# EAGLE design 8x8 led matrix 2 layer (EAGLE 6.4)
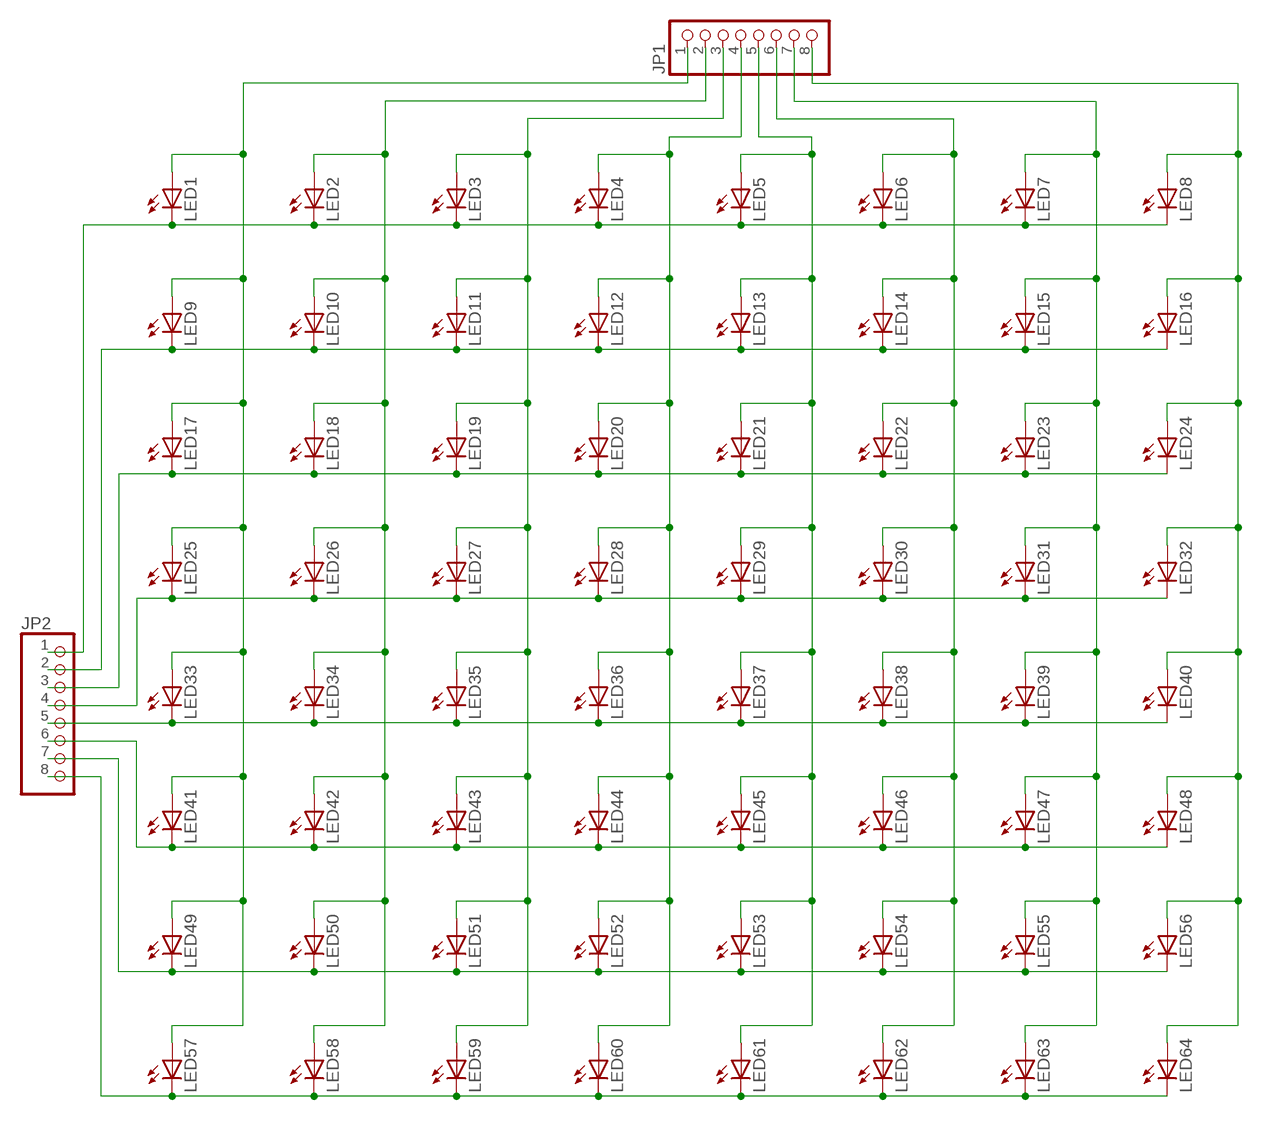
[diagram p0: schematic, sheet 1]

## Parts
JP1  PINHD-1X8  [1X08]
JP2  PINHD-1X8  [1X08]
LED1  LED5MM  [LED5MM]
LED2  LED5MM  [LED5MM]
LED3  LED5MM  [LED5MM]
LED4  LED5MM  [LED5MM]
LED5  LED5MM  [LED5MM]
LED6  LED5MM  [LED5MM]
LED7  LED5MM  [LED5MM]
LED8  LED5MM  [LED5MM]
LED9  LED5MM  [LED5MM]
LED10  LED5MM  [LED5MM]
LED11  LED5MM  [LED5MM]
LED12  LED5MM  [LED5MM]
LED13  LED5MM  [LED5MM]
LED14  LED5MM  [LED5MM]
LED15  LED5MM  [LED5MM]
LED16  LED5MM  [LED5MM]
LED17  LED5MM  [LED5MM]
LED18  LED5MM  [LED5MM]
LED19  LED5MM  [LED5MM]
LED20  LED5MM  [LED5MM]
LED21  LED5MM  [LED5MM]
LED22  LED5MM  [LED5MM]
LED23  LED5MM  [LED5MM]
LED24  LED5MM  [LED5MM]
LED25  LED5MM  [LED5MM]
LED26  LED5MM  [LED5MM]
LED27  LED5MM  [LED5MM]
LED28  LED5MM  [LED5MM]
LED29  LED5MM  [LED5MM]
LED30  LED5MM  [LED5MM]
LED31  LED5MM  [LED5MM]
LED32  LED5MM  [LED5MM]
LED33  LED5MM  [LED5MM]
LED34  LED5MM  [LED5MM]
LED35  LED5MM  [LED5MM]
LED36  LED5MM  [LED5MM]
LED37  LED5MM  [LED5MM]
LED38  LED5MM  [LED5MM]
LED39  LED5MM  [LED5MM]
LED40  LED5MM  [LED5MM]
LED41  LED5MM  [LED5MM]
LED42  LED5MM  [LED5MM]
LED43  LED5MM  [LED5MM]
LED44  LED5MM  [LED5MM]
LED45  LED5MM  [LED5MM]
LED46  LED5MM  [LED5MM]
LED47  LED5MM  [LED5MM]
LED48  LED5MM  [LED5MM]
LED49  LED5MM  [LED5MM]
LED50  LED5MM  [LED5MM]
LED51  LED5MM  [LED5MM]
LED52  LED5MM  [LED5MM]
LED53  LED5MM  [LED5MM]
LED54  LED5MM  [LED5MM]
LED55  LED5MM  [LED5MM]
LED56  LED5MM  [LED5MM]
LED57  LED5MM  [LED5MM]
LED58  LED5MM  [LED5MM]
LED59  LED5MM  [LED5MM]
LED60  LED5MM  [LED5MM]
LED61  LED5MM  [LED5MM]
LED62  LED5MM  [LED5MM]
LED63  LED5MM  [LED5MM]
LED64  LED5MM  [LED5MM]

## Nets
N$12: JP1.4 LED4.A LED12.A LED20.A LED28.A LED36.A LED44.A LED52.A LED60.A
N$14: JP1.5 LED5.A LED13.A LED21.A LED29.A LED37.A LED45.A LED53.A LED61.A
N$17: JP1.1 LED1.A LED9.A LED17.A
N$21: JP1.3 LED3.A LED11.A LED19.A LED27.A LED35.A LED43.A LED51.A LED59.A
N$28: JP1.6 LED6.A LED14.A LED22.A LED30.A LED38.A LED46.A LED54.A LED62.A
N$30: JP1.7 LED7.A LED15.A LED23.A LED31.A LED39.A LED47.A LED55.A LED63.A
N$33: JP2.1 LED1.K(C) LED2.K(C) LED3.K(C) LED4.K(C) LED5.K(C) LED6.K(C) LED7.K(C) LED8.K(C)
N$50: JP2.2 LED9.K(C) LED10.K(C) LED11.K(C) LED12.K(C) LED13.K(C) LED14.K(C) LED15.K(C) LED16.K(C)
N$67: JP2.3 LED17.K(C) LED18.K(C) LED19.K(C) LED20.K(C) LED21.K(C) LED22.K(C) LED23.K(C) LED24.K(C)
N$76: LED25.A LED33.A LED41.A LED49.A LED57.A
N$84: JP2.4 LED25.K(C) LED26.K(C) LED27.K(C) LED28.K(C) LED29.K(C) LED30.K(C) LED31.K(C) LED32.K(C)
N$101: JP2.5 LED33.K(C) LED34.K(C) LED35.K(C) LED36.K(C) LED37.K(C) LED38.K(C) LED39.K(C) LED40.K(C)
N$118: JP2.6 LED41.K(C) LED42.K(C) LED43.K(C) LED44.K(C) LED45.K(C) LED46.K(C) LED47.K(C) LED48.K(C)
N$134: JP1.8 LED8.A LED16.A LED24.A LED32.A LED40.A LED48.A LED56.A LED64.A
N$135: JP2.7 LED49.K(C) LED50.K(C) LED51.K(C) LED52.K(C) LED53.K(C) LED54.K(C) LED55.K(C) LED56.K(C)
N$145: JP1.2 LED2.A LED10.A LED18.A LED26.A LED34.A LED42.A LED50.A LED58.A
N$152: JP2.8 LED57.K(C) LED58.K(C) LED59.K(C) LED60.K(C) LED61.K(C) LED62.K(C) LED63.K(C) LED64.K(C)

## Library data of the parts
JP1 JP2 = pinhead:PINHD-1X8: PIN HEADER
LED1-LED64 = led:LED: LED OSRAM: - CHIPLED LG R971, LG N971, LY N971, LG Q971, LY Q971, LO R971, LY R971 LH N974, LH R974 LS Q976, LO Q976, LY Q976 LO Q996 - Hyper CHIPLED LW Q18S LB Q993, LB Q99A, LB R99A - SideLED LS A670, LO A670, LY A670, LG A670, LP A670 LB A673, LV A673, LT A673, LW A673 LH A674 LY A675 LS A676, LA A676, LO A676, LY A676, LW A676 LS A679, LY A679, LG A679 - Hyper Micro SIDELED® LS Y876, LA Y876, LO Y876, LY Y876 LT Y87S - SmartLED LW L88C, LW L88S LB L89C, LB L89S, LG L890 LS L89K, LO L89K, LY L89K LS L896, LA L896, LO L896, LY L896 - TOPLED LS T670, LO T670, LY T670, LG T670, LP T670 LSG T670, LSP T670, LSY T670, LOP T670, LYG T670 LG T671, LOG T671, LSG T671 LB T673, LV T673, LT T673, LW T673 LH T674 LS T676, LA T676, LO T676, LY T676, LB T676, LH T676, LSB T676, LW T676 LB T67C, LV T67C, LT T67C, LS T67K, LO T67K, LY T67K, LW E67C LS E67B, LA E67B, LO E67B, LY E67B, LB E67C, LV E67C, LT E67C LW T67C LS T679, LY T679, LG T679 LS T770, LO T770, LY T770, LG T770, LP T770 LB T773, LV T773, LT T773, LW T773 LH T774 LS E675, LA E675, LY E675, LS T675 LS T776, LA T776, LO T776, LY T776, LB T776 LHGB T686 LT T68C, LB T68C - Hyper Mini TOPLED® LB M676 - Mini TOPLED Santana® LG M470 LS M47K, LO M47K, LY M47K Source: http://www.osram.convergy.de LUXEON: - LUMILED® LXK2-PW12-R00, LXK2-PW12-S00, LXK2-PW14-U00, LXK2-PW14-V00 LXK2-PM12-R00, LXK2-PM12-S00, LXK2-PM14-U00 LXK2-PE12-Q00, LXK2-PE12-R00, LXK2-PE12-S00, LXK2-PE14-T00, LXK2-PE14-U00 LXK2-PB12-K00, LXK2-PB12-L00, LXK2-PB12-M00, LXK2-PB14-N00, LXK2-PB14-P00, LXK2-PB14-Q00 LXK2-PR12-L00, LXK2-PR12-M00, LXK2-PR14-Q00, LXK2-PR14-R00 LXK2-PD12-Q00, LXK2-PD12-R00, LXK2-PD12-S00 LXK2-PH12-R00, LXK2-PH12-S00 LXK2-PL12-P00, LXK2-PL12-Q00, LXK2-PL12-R00 Source: www.luxeon.com KINGBRIGHT: KA-3528ASYC Source: www.kingbright.com

## Board
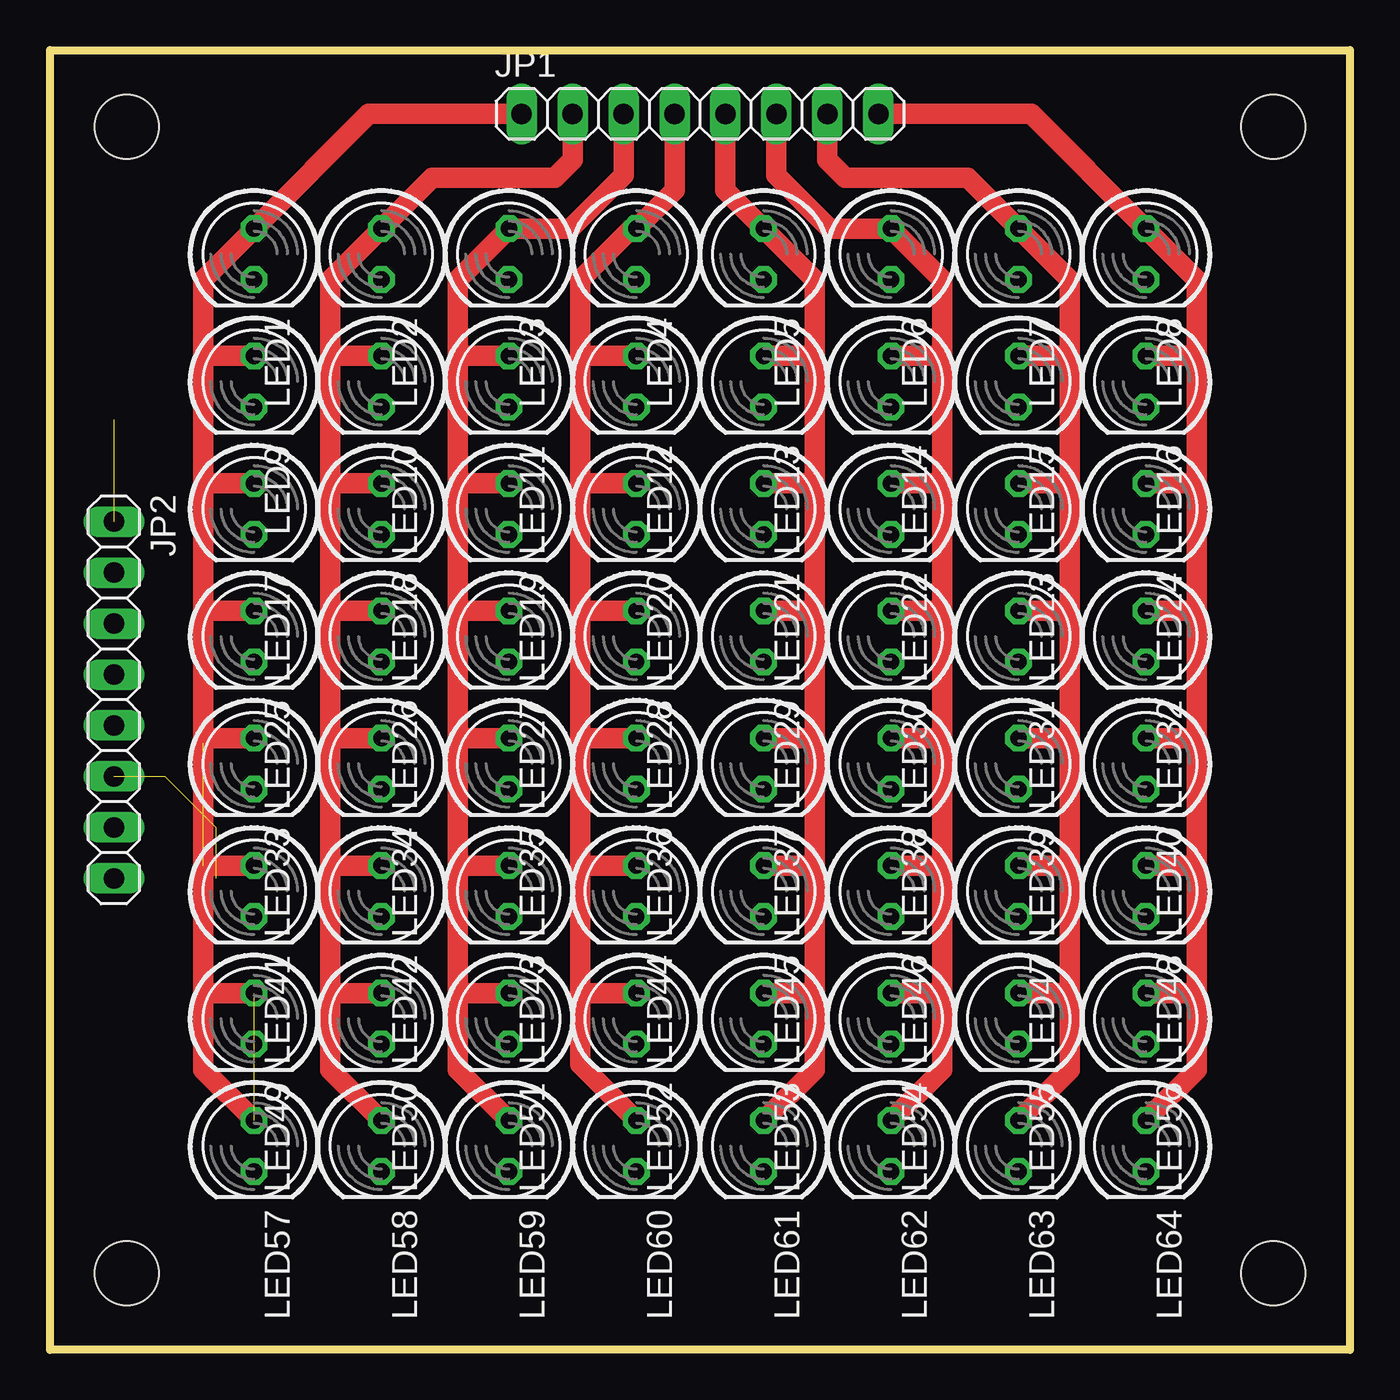
[diagram p1: board, top side]
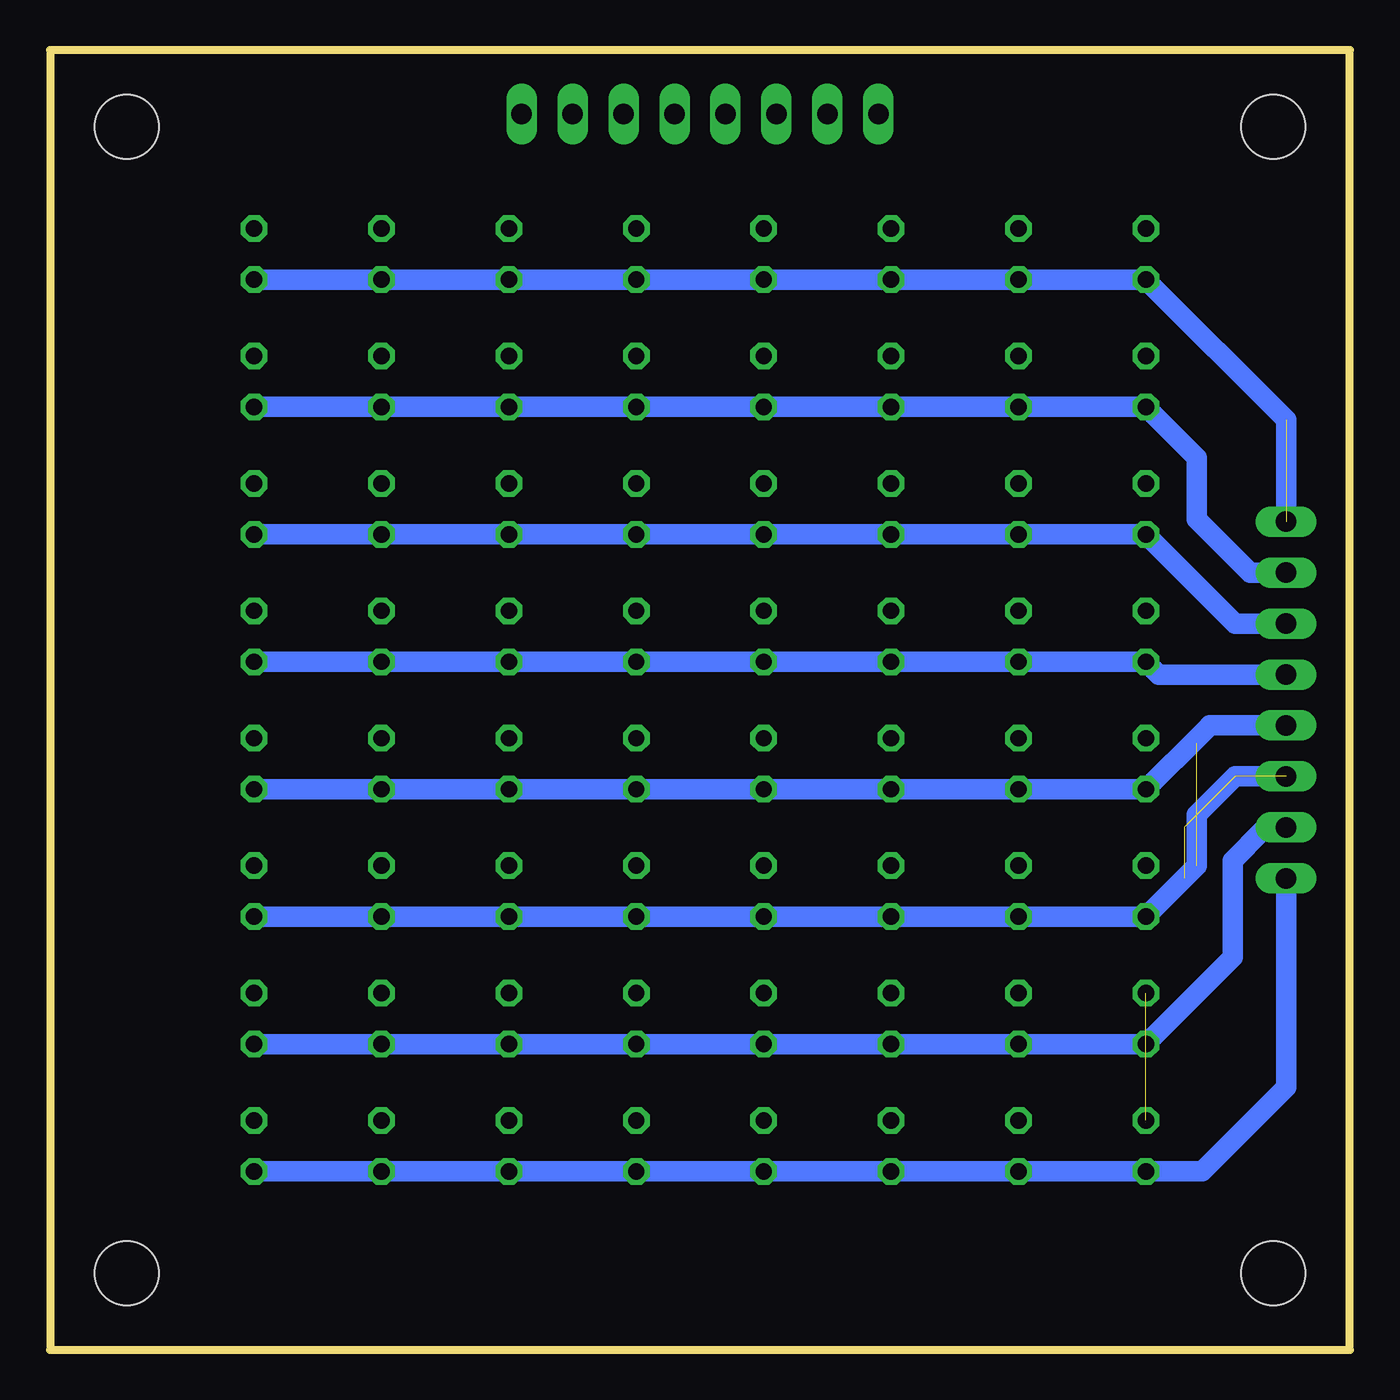
[diagram p2: board, bottom side, seen from below]

Size 64.77 x 64.77 mm. Coordinates in mm from the lower left corner, seen from the top.
Outline: 64.77,0 0,0 0,64.77 64.77,64.77 64.77,0
Copper layers (1*16): Top 0.035mm / dielectric 1.5mm / Bottom 0.035mm
Design rules "default": minimum track width 10mil, minimum drill 24mil, track to track 8mil, track to pad 8mil, pad to pad 8mil, via to via 8mil, smd to smd 8mil, copper to edge 40mil, drill to drill 8mil, minimum pad ring 10mil, minimum via ring 8mil, stop-mask expansion 4mil, vias tented up to drill 0mil, thermal gap 10mil
Holes 3.2 mm at -15.24,7.62 3.81,3.81 60.96,3.81 3.81,60.96 60.96,60.96

### Footprints (pad centres in the part's own frame; a part is rotated, then mirrored left to right if it is on the bottom)
1X08 = drill 1.016 long: 1 -8.89,0; 2 -6.35,0; 3 -3.81,0; 4 -1.27,0; 5 1.27,0; 6 3.81,0; 7 6.35,0; 8 8.89,0
LED5MM = drill 0.813 octagon: A -1.27,0; K 1.27,0

### Placement (x,y rotation side)
JP1  32.38,61.6 0 top
JP2  3.17,32.38 270 top
LED1  10.16,54.61 270 top
LED2  16.51,54.61 270 top
LED3  22.86,54.61 270 top
LED4  29.21,54.61 270 top
LED5  35.56,54.61 270 top
LED6  41.91,54.61 270 top
LED7  48.26,54.61 270 top
LED8  54.61,54.61 270 top
LED9  10.16,48.26 270 top
LED10  16.51,48.26 270 top
LED11  22.86,48.26 270 top
LED12  29.21,48.26 270 top
LED13  35.56,48.26 270 top
LED14  41.91,48.26 270 top
LED15  48.26,48.26 270 top
LED16  54.61,48.26 270 top
LED17  10.16,41.91 270 top
LED18  16.51,41.91 270 top
LED19  22.86,41.91 270 top
LED20  29.21,41.91 270 top
LED21  35.56,41.91 270 top
LED22  41.91,41.91 270 top
LED23  48.26,41.91 270 top
LED24  54.61,41.91 270 top
LED25  10.16,35.56 270 top
LED26  16.51,35.56 270 top
LED27  22.86,35.56 270 top
LED28  29.21,35.56 270 top
LED29  35.56,35.56 270 top
LED30  41.91,35.56 270 top
LED31  48.26,35.56 270 top
LED32  54.61,35.56 270 top
LED33  10.16,29.21 270 top
LED34  16.51,29.21 270 top
LED35  22.86,29.21 270 top
LED36  29.21,29.21 270 top
LED37  35.56,29.21 270 top
LED38  41.91,29.21 270 top
LED39  48.26,29.21 270 top
LED40  54.61,29.21 270 top
LED41  10.16,22.86 270 top
LED42  16.51,22.86 270 top
LED43  22.86,22.86 270 top
LED44  29.21,22.86 270 top
LED45  35.56,22.86 270 top
LED46  41.91,22.86 270 top
LED47  48.26,22.86 270 top
LED48  54.61,22.86 270 top
LED49  10.16,16.51 270 top
LED50  16.51,16.51 270 top
LED51  22.86,16.51 270 top
LED52  29.21,16.51 270 top
LED53  35.56,16.51 270 top
LED54  41.91,16.51 270 top
LED55  48.26,16.51 270 top
LED56  54.61,16.51 270 top
LED57  10.16,10.16 270 top
LED58  16.51,10.16 270 top
LED59  22.86,10.16 270 top
LED60  29.21,10.16 270 top
LED61  35.56,10.16 270 top
LED62  41.91,10.16 270 top
LED63  48.26,10.16 270 top
LED64  54.61,10.16 270 top

### Tracks (layer width: path | path; a pad name or v marks a point on that pad's centre or on a via)
N$12
  Top 1.016: JP1.4 31.12,57.79 LED4.A 28.96,55.88 26.42,53.34 26.42,49.53 | 26.42,49.53 26.42,43.18 | 26.42,43.18 26.42,36.83 | 26.42,36.83 26.42,30.23 | 26.42,30.23 26.42,24.13 | 26.42,24.13 26.42,17.78 | 26.42,17.78 26.42,14.22 LED60.A | LED52.A 26.42,17.78 | LED44.A 26.42,24.13 | LED36.A 26.67,30.48 26.42,30.23 | LED28.A 26.42,36.83 | LED20.A 26.42,43.18 | LED12.A 26.42,49.53
N$14
  Top 1.016: JP1.5 33.66,57.79 LED5.A 38.1,53.34 38.1,49.53 | 38.1,49.53 38.1,43.18 | 38.1,43.18 38.1,36.83 | 38.1,36.83 38.1,30.48 | 38.1,30.48 38.1,24.13 | 38.1,24.13 38.1,17.78 | 38.1,17.78 38.1,13.97 LED61.A | LED53.A 38.1,17.78 | LED45.A 38.1,24.13 | LED37.A 38.1,30.48 | LED29.A 38.1,36.83 | LED21.A 38.1,43.18 | LED13.A 38.1,49.53
N$17
  Top 1.016: JP1.1 15.87,61.6 LED1.A 7.62,53.34 7.62,49.53 | 7.62,49.53 7.62,43.18 | 7.62,43.18 7.62,13.97 10.16,11.43 | LED9.A 7.62,49.53 | LED17.A 7.62,43.18
N$21
  Top 1.016: JP1.3 28.58,58.55 25.91,55.88 LED3.A 20.32,53.34 20.32,49.28 | LED59.A 20.32,13.97 20.32,17.78 | 20.32,49.28 20.32,43.18 | 20.32,43.18 20.32,36.58 | 20.32,36.58 20.32,30.23 | 20.32,30.23 20.32,23.88 | 20.32,23.88 20.32,17.78 | LED11.A 20.57,49.53 20.32,49.28 | LED19.A 20.32,43.18 | LED27.A 20.57,36.83 20.32,36.58 | LED35.A 20.57,30.48 20.32,30.23 | LED43.A 20.57,24.13 20.32,23.88 | LED51.A 20.32,17.78
N$28
  Top 1.016: JP1.6 36.2,58.55 38.86,55.88 LED6.A 44.45,53.34 44.45,49.53 | 44.45,49.53 44.45,43.18 | 44.45,43.18 44.45,36.83 | 44.45,36.83 44.45,30.48 | 44.45,30.48 44.45,24.13 | 44.45,24.13 44.45,17.78 | 44.45,17.78 44.45,13.97 LED62.A | LED54.A 44.45,17.78 | LED46.A 44.45,24.13 | LED38.A 44.45,30.48 | LED30.A 44.45,36.83 | LED22.A 44.45,43.18 | LED14.A 44.45,49.53
N$30
  Top 1.016: JP1.7 38.73,59.31 39.62,58.42 45.72,58.42 LED7.A 50.8,53.34 50.8,49.53 | 50.8,49.53 50.8,43.18 | 50.8,43.18 50.8,36.83 | 50.8,36.83 50.8,30.48 | 50.8,30.48 50.8,24.13 | 50.8,24.13 50.8,18.03 | 50.8,18.03 50.8,13.97 LED63.A | LED55.A 50.55,17.78 50.8,18.03 | LED47.A 50.8,24.13 | LED39.A 50.8,30.48 | LED31.A 50.8,36.83 | LED23.A 50.8,43.18 | LED15.A 50.8,49.53
N$33  (1 unrouted)
  Bottom 1.016: LED8.K LED7.K LED6.K LED5.K LED4.K LED3.K LED2.K LED1.K 3.17,46.35 JP2.1
N$50
  Bottom 1.016: LED16.K LED15.K LED14.K LED13.K LED12.K LED11.K LED10.K LED9.K 7.62,44.45 7.62,41.4 4.95,38.73 JP2.2
N$67
  Bottom 1.016: LED24.K LED23.K LED22.K LED21.K LED20.K LED19.K LED18.K LED17.K 5.71,36.2 JP2.3
N$76  (2 unrouted)
  Top 1.016: LED25.A 7.62,36.83 7.62,30.48 7.87,30.48 | 7.87,30.48 LED33.A | LED41.A 7.62,24.13 7.62,17.78 LED49.A | 7.62,30.23 7.87,30.48
N$84
  Bottom 1.016: LED32.K LED31.K LED30.K LED29.K LED28.K LED27.K LED26.K LED25.K 9.53,33.66 JP2.4
N$101
  Bottom 1.016: LED40.K LED39.K LED38.K LED37.K LED36.K LED35.K LED34.K LED33.K 7.37,30.73 7.11,30.99 6.98,31.12 JP2.5
N$118  (3 unrouted)
  Bottom 1.016: LED48.K LED47.K LED46.K LED45.K LED44.K LED43.K LED42.K LED41.K 7.62,24.13 7.62,26.67 5.71,28.58 JP2.6
N$134
  Top 1.016: JP1.8 48.9,61.6 LED8.A 57.15,53.34 57.15,49.53 | 57.15,49.53 57.15,43.18 | 57.15,43.18 57.15,36.83 | 57.15,36.83 57.15,30.48 | 57.15,30.48 57.15,24.13 | 57.15,24.13 57.15,17.78 | 57.15,17.78 57.15,13.97 LED64.A | LED56.A 57.15,17.78 | LED48.A 57.15,24.13 | LED40.A 57.15,30.48 | LED32.A 57.15,36.83 | LED24.A 57.15,43.18 | LED16.A 57.15,49.53
N$135
  Bottom 1.016: LED56.K LED55.K LED54.K LED53.K LED52.K LED51.K LED50.K LED49.K 5.84,19.56 5.84,24.38 4.32,25.91 3.3,25.91 JP2.7
N$145
  Top 1.016: JP1.2 26.04,59.31 25.15,58.42 19.05,58.42 LED2.A 13.97,53.34 13.97,49.53 | 13.97,49.53 13.97,43.18 | 13.97,43.18 13.97,36.58 | 13.97,36.58 13.97,30.23 | 13.97,30.23 13.97,24.13 | 13.97,24.13 13.97,17.78 | 13.97,17.78 13.97,13.97 LED58.A | LED10.A 13.97,49.53 | LED18.A 13.97,43.18 | LED26.A 14.22,36.83 13.97,36.58 | LED34.A 14.22,30.48 13.97,30.23 | LED42.A 13.97,24.13 | LED50.A 13.97,17.78
N$152
  Bottom 1.016: LED63.K LED64.K LED62.K LED61.K LED60.K LED59.K LED58.K LED57.K 7.37,8.89 3.17,13.08 JP2.8

### Text on the board
Document: C 1-8 | R 1-8